# Altium schematic sheet esp32-devkit-evse_2023-04-27.schdoc
size 347 x 264 mm
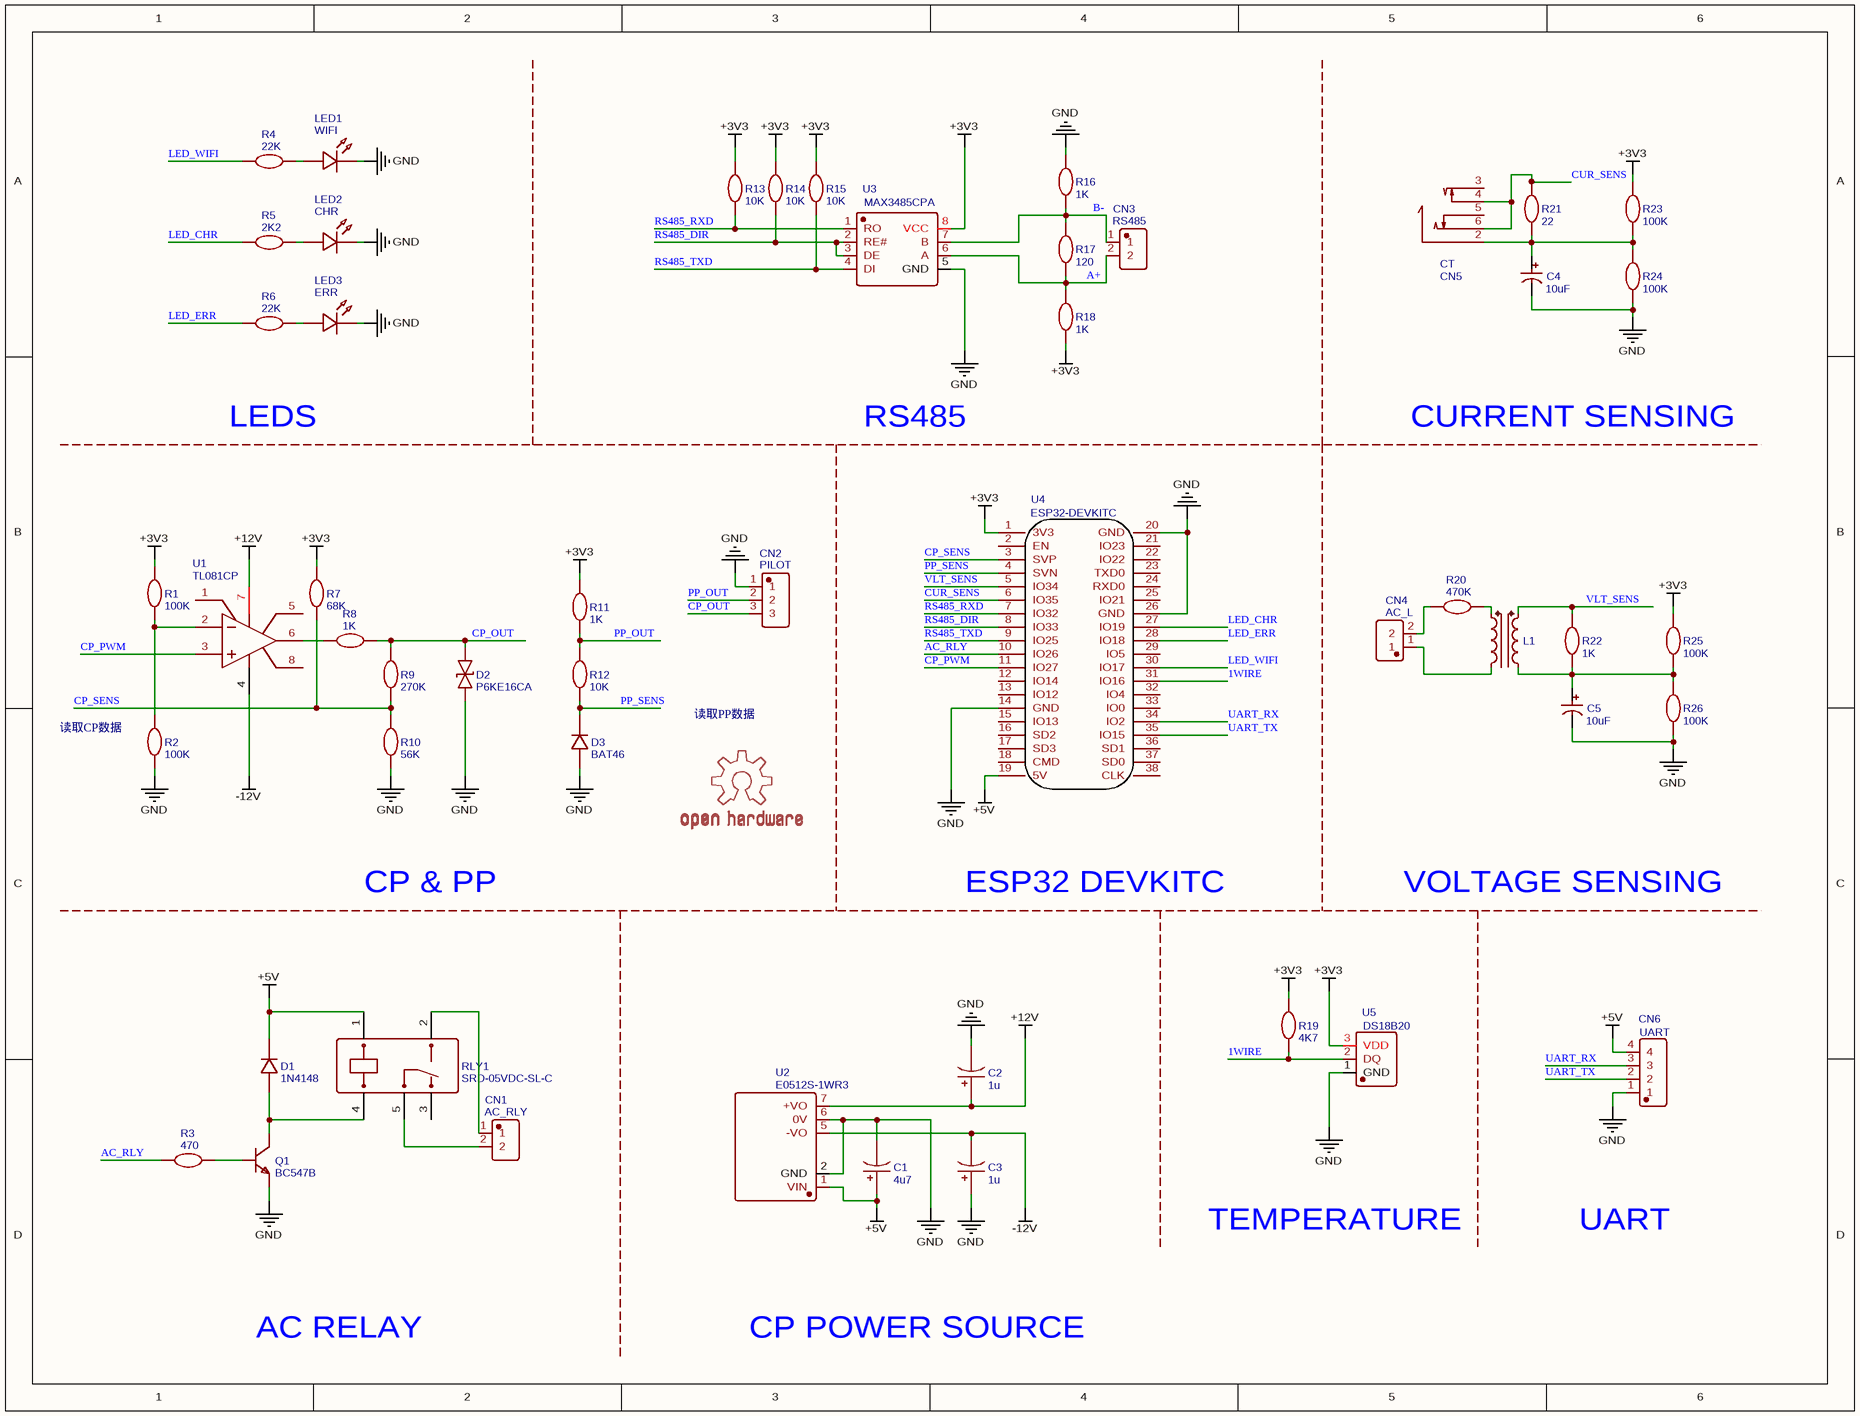
[diagram p0: esp32-devkit-evse_2023-04-27.schdoc]

## Parts
C1  4u7  [CAP-D5.0×F2.0]
C2  1u  [CAP-D5.0×F2.0]
C3  1u  [CAP-D5.0×F2.0]
C4  10uF  [CAP-TH_BD5.0-P2.00-D0.8-FD]
C5  10uF  [CAP-TH_BD5.0-P2.00-D0.8-FD]
CN1  AC_RLY  [CONN-TH_P5.00_KF301-5.0-2P]
CN2  PILOT  [CONN-TH_3P-P5.00_KF301-5.0-3P]
CN3  RS485  [CONN-TH_P5.00_KF301-5.0-2P]
CN4  AC_L  [CONN-TH_P5.00_KF301-5.0-2P]
CN5  CT  [AUDIO-TH_HOOYA_PJ-358]
CN6  UART  [CONN-TH_B4B-XH-A-G]
D1  1N4148  [DO-35_BD2.0-L4.2-P8.20-D0.5-RD]
D2  P6KE16CA  [DO-15_BD3.1-L6.7-P10.70-D0.9-BI]
D3  BAT46  [DO-35_BD2.0-L4.2-P8.20-D0.5-RD]
L1  Qingxian  [ZMPT107-1]  (value not drawn)
LED1  WIFI  [LED-TH_BD3.0_BLUE]
LED2  CHR  [LED-TH_BD3.0_GREEN]
LED3  ERR  [LED-TH_BD3.0_RED]
LOGO1  OSHW-LOGOL  [OSHW-LOGO-L]  (value not drawn)
Q1  BC547B  [TO-92-3_L4.9-W3.7-P2.54-L]
R1  100K  [R_AXIAL-0.4]
R2  100K  [R_AXIAL-0.4]
R3  470  [R_AXIAL-0.4]
R4  22K  [R_AXIAL-0.4]
R5  2K2  [R_AXIAL-0.4]
R6  22K  [R_AXIAL-0.4]
R7  68K  [R_AXIAL-0.4]
R8  1K  [R_AXIAL-0.4]
R9  270K  [R_AXIAL-0.4]
R10  56K  [R_AXIAL-0.4]
R11  1K  [R_AXIAL-0.4]
R12  10K  [R_AXIAL-0.4]
R13  10K  [R_AXIAL-0.4]
R14  10K  [R_AXIAL-0.4]
R15  10K  [R_AXIAL-0.4]
R16  1K  [R_AXIAL-0.4]
R17  120  [R_AXIAL-0.4]
R18  1K  [R_AXIAL-0.4]
R19  4K7  [R_AXIAL-0.4]
R20  470K  [R_AXIAL-0.4]
R21  22  [R_AXIAL-0.4]
R22  1K  [R_AXIAL-0.4]
R23  100K  [R_AXIAL-0.4]
R24  100K  [R_AXIAL-0.4]
R25  100K  [R_AXIAL-0.4]
R26  100K  [R_AXIAL-0.4]
RLY1  SRD-05VDC-SL-C  [RELAY-TH_SRD-XXVDC-XL-C]
U1  TL081CP  [PDIP-8_L9.3-W6.4-P2.54-LS7.6-BL]
U2  E0512S-1WR3  [PWRM-TH_E05XXS-1WR3]
U3  MAX3485CPA  [DIP-8_L9.8-W6.6-P2.54-LS7.6-BL]
U4  ESP32-DEVKITC  [ESP32-DEVKITC-32D]
U5  DS18B20  [TO-92-3_L4.9-W3.7-P2.54-L]

## Nets
+3V3: R1.1 R7.1 R11.1 R13.1 R14.1 R15.1 R18.2 R19.1 R23.1 R25.1 U3.8(VCC) U4.1(3V3) U5.3(VDD)
+5V: C1.1 CN6.4 D1.1 RLY1.1 U2.1(VIN) U4.19(5V)
+12V: C2.1 U1.7(V+) U2.7(+VO)
-12V: C3.2 U1.4(V-) U2.5(-VO)
GND: C1.2 C2.2 C3.1 C4.2 C5.2 CN2.1 CN6.1 D2.1(K) D3.2 LED1.2 LED2.2 LED3.2 Q1.3(E) R2.2 R10.2 R16.1 R24.2 R26.2 U2.2(GND) U2.6(0V) U3.5(GND) U4.14(GND) U4.20(GND) U4.26(GND) U5.1(GND)
1WIRE: R19.2 U4.31(IO16) U5.2(DQ)
A+: CN3.2 R17.2 R18.1 U3.6(A)
AC_RLY: R3.1 U4.10(IO26)
B-: CN3.1 R16.2 R17.1 U3.7(B)
CP_OUT: CN2.3 D2.2(A) R8.2 R9.1
CP_PWM: U1.3(IN+) U4.11(IO27)
CP_SENS: R7.2 R9.2 R10.1 U4.3(SVP)
CUR_SENS: CN5.4 CN5.6 R21.1 U4.6(IO35)
LED_CHR: R5.1 U4.27(IO19)
LED_ERR: R6.1 U4.28(IO18)
LED_WIFI: R4.1 U4.30(IO17)
PP_OUT: CN2.2 R11.2 R12.1
PP_SENS: D3.1 R12.2 U4.4(SVN)
RS485_DIR: R14.2 U3.2(RE#) U3.3(DE) U4.8(IO33)
RS485_RXD: R13.2 U3.1(RO) U4.7(IO32)
RS485_TXD: R15.2 U3.4(DI) U4.9(IO25)
UART_RX: CN6.3 U4.34(IO2)
UART_TX: CN6.2 U4.35(IO15)
VLT_SENS: L1.1 R22.1 U4.5(IO34)
NetC4_1: C4.1 CN5.2 R21.2 R23.2 R24.1
NetC5_1: C5.1 L1.2 R22.2 R25.2 R26.1
NetCN1_1: CN1.1 RLY1.2
NetCN1_2: CN1.2 RLY1.5
NetCN4_1: CN4.1 L1.4
NetCN4_2: CN4.2 R20.1
NetD1_2: D1.2 Q1.1(C) RLY1.4
NetL1_3: L1.3 R20.2
NetLED1_1: LED1.1 R4.2
NetLED2_1: LED2.1 R5.2
NetLED3_1: LED3.1 R6.2
NetQ1_2: Q1.2(B) R3.2
NetR1_2: R1.2 R2.1 U1.2(IN-)
NetR8_1: R8.1 U1.6(OUT)

Not connected (* = marked no-connect by the designer): CN5 3 5; RLY1 3; U1 1(OS_NULL) 5(OS_NULL) 8(NC); U4 2(EN) 12(IO14) 13(IO12) 15(IO13) 16(SD2) 17(SD3) 18(CMD) 21(IO23) 22(IO22) 23(TXD0) 24(RXD0) 25(IO21) 29(IO5) 32(IO4) 33(IO0) 36(SD1) 37(SD0) 38(CLK)

## Notes on the sheet
- LEDS
- RS485
- CURRENT SENSING
- 读取CP数据
- 读取PP数据
- CP & PP
- ESP32 DEVKITC
- VOLTAGE SENSING
- TEMPERATURE
- UART
- AC RELAY
- CP POWER SOURCE

## Library data of the parts
C1 = 4u7: nameAlias: Value(F); Contributor: LCEDA_Lib; spicePre: C; spiceSymbolName: CE_TH_D5.0×F2.0_US
C2 C3 = 1u: nameAlias: Value(F); Contributor: LCEDA_Lib; spicePre: C; spiceSymbolName: CE_TH_D5.0×F2.0_US
C4 C5 = 10uF: BOM_Manufacturer: ValuePro; BOM_Manufacturer Part: 10uF 25V 5*11; nameAlias: Capacitance; BOM_Supplier: LCSC; BOM_Supplier Part: C43347; spicePre: C; spiceSymbolName: 10uF 25V 5*11
CN1 = AC_RLY: BOM_Manufacturer: Cixi Kefa Elec; BOM_Manufacturer Part: KF301-5.0-2P; Contributor: LCSC; Package Display: No; BOM_Supplier: LCSC; BOM_Supplier Part: C474881; spicePre: U; spiceSymbolName: KF301-5.0-2P
CN2 = PILOT: BOM_Manufacturer: Cixi Kefa Elec; BOM_Manufacturer Part: KF301-5.0-3P; Contributor: LCSC; BOM_Supplier: LCSC; BOM_Supplier Part: C474882; spicePre: U; spiceSymbolName: KF301-5.0-3P
CN3 = RS485: BOM_Manufacturer: Cixi Kefa Elec; BOM_Manufacturer Part: KF301-5.0-2P; Contributor: LCSC; Package Display: No; BOM_Supplier: LCSC; BOM_Supplier Part: C474881; spicePre: U; spiceSymbolName: KF301-5.0-2P
CN4 = AC_L: BOM_Manufacturer: Cixi Kefa Elec; BOM_Manufacturer Part: KF301-5.0-2P; Contributor: LCSC; Package Display: No; BOM_Supplier: LCSC; BOM_Supplier Part: C474881; spicePre: U; spiceSymbolName: KF301-5.0-2P
CN5 = CT: BOM_Manufacturer: HOOYA(香港皓宇); BOM_Manufacturer Part: PJ-358; Contributor: LCSC; BOM_Supplier: LCSC; BOM_Supplier Part: C2939193; spicePre: C; spiceSymbolName: PJ-358
CN6 = UART: BOM_Manufacturer: JST; BOM_Manufacturer Part: B4B-XH-A-G; Contributor: LCSC; BOM_Supplier: LCSC; BOM_Supplier Part: C594232; BOM_JLCPCB Part Class: Extended Part; spicePre: U; spiceSymbolName: B4B-XH-A-G
D1 = 1N4148: BOM_Manufacturer: STMicroelectronics; Contributor: LCSC; BOM_Supplier: LCSC; BOM_Supplier Part: C13769; BOM_Manufacturer Part: 1N4148; spicePre: D; spiceSymbolName: 1N4148
D2 = P6KE16CA: BOM_Manufacturer: Yenji Elec; Contributor: LCSC; BOM_Supplier: LCSC; BOM_Supplier Part: C157801; BOM_Manufacturer Part: P6KE16CA; spicePre: D; spiceSymbolName: P6KE16CA_C157801
D3 = BAT46: Contributor: LCSC; spicePre: D; spiceSymbolName: 1N4148
L1 = Qingxian: BOM_Manufacturer: Qingxian Zeming Langxi Elec; BOM_Manufacturer Part: ZMPT107; nameAlias: Value; Contributor: LCSC; BOM_Supplier: LCSC; BOM_Supplier Part: C94572; spicePre: L; spiceSymbolName: ZMPT107
LED1 = WIFI: BOM_Manufacturer: EVERLIGHT(台湾亿光); BOM_Manufacturer Part: 204-10SUBC/S400-A4; Contributor: LCEDA_Lib; BOM_Supplier Part: C86881; BOM_Supplier: LCSC; spicePre: L; spiceSymbolName: LED-TH-3mm_B
LED2 = CHR: BOM_Manufacturer: EVERLIGHT(台湾亿光); BOM_Manufacturer Part: 204-10SYGD/S530-E3; Contributor: LCEDA_Lib; BOM_Supplier Part: C85161; spicePre: L; spiceSymbolName: LED-TH-3mm_G
LED3 = ERR: BOM_Manufacturer: EVERLIGHT(台湾亿光); BOM_Manufacturer Part: 204-10SDRD/S530-A3-L; Contributor: LCEDA_Lib; BOM_Supplier Part: C84774; BOM_Supplier: LCSC; spicePre: L; spiceSymbolName: LED-TH-3mm_R
LOGO1 = OSHW-LOGOL: Contributor: David Asassin; spicePre: L; spiceSymbolName: OSHW-LOGOL
Q1 = BC547B: BOM_Manufacturer: CJ; BOM_Manufacturer Part: BC547B Tube; BOM_Supplier: LCSC; BOM_Supplier Part: C2092; BOM_JLCPCB Part Class: Extended Part; spicePre: Q; spiceSymbolName: BC547B Tube
R1 R2 R23-R26 = 100K: nameAlias: Value(Ω); Contributor: LCEDA_Lib; spicePre: R; spiceSymbolName: R_AXIAL-0.4_EU
R3 = 470: nameAlias: Value(Ω); Contributor: LCEDA_Lib; spicePre: R; spiceSymbolName: R_AXIAL-0.4_EU
R4 R6 = 22K: nameAlias: Value(Ω); Contributor: LCEDA_Lib; spicePre: R; spiceSymbolName: R_AXIAL-0.4_EU
R5 = 2K2: nameAlias: Value(Ω); Contributor: LCEDA_Lib; spicePre: R; spiceSymbolName: R_AXIAL-0.4_EU
R7 = 68K: nameAlias: Value(Ω); Contributor: LCEDA_Lib; spicePre: R; spiceSymbolName: R_AXIAL-0.4_EU
R8 R11 R16 R18 R22 = 1K: nameAlias: Value(Ω); Contributor: LCEDA_Lib; spicePre: R; spiceSymbolName: R_AXIAL-0.4_EU
R9 = 270K: nameAlias: Value(Ω); Contributor: LCEDA_Lib; spicePre: R; spiceSymbolName: R_AXIAL-0.4_EU
R10 = 56K: nameAlias: Value(Ω); Contributor: LCEDA_Lib; spicePre: R; spiceSymbolName: R_AXIAL-0.4_EU
R12-R15 = 10K: nameAlias: Value(Ω); Contributor: LCEDA_Lib; spicePre: R; spiceSymbolName: R_AXIAL-0.4_EU
R17 = 120: nameAlias: Value(Ω); Contributor: LCEDA_Lib; spicePre: R; spiceSymbolName: R_AXIAL-0.4_EU
R19 = 4K7: nameAlias: Value(Ω); Contributor: LCEDA_Lib; spicePre: R; spiceSymbolName: R_AXIAL-0.4_EU
R20 = 470K: nameAlias: Value(Ω); Contributor: LCEDA_Lib; spicePre: R; spiceSymbolName: R_AXIAL-0.4_EU
R21 = 22: nameAlias: Value(Ω); Contributor: LCEDA_Lib; spicePre: R; spiceSymbolName: R_AXIAL-0.4_EU
RLY1 = SRD-05VDC-SL-C: BOM_Manufacturer: SONGLE; BOM_Supplier: LCSC; BOM_Manufacturer Part: SRD-05VDC-SL-C; image: //image.lceda.cn/szlcsc/C35449.jpg; BOM_Supplier Part: C35449; spicePre: R; spiceSymbolName: SRD-05VDC-SL-C
U1 = TL081CP: BOM_Manufacturer: TI; BOM_Supplier: LCSC; BOM_Manufacturer Part: TL081CP; BOM_Supplier Part: C38969; BOM_JLCPCB Part Class: Extended Part; spicePre: U; spiceSymbolName: TL081CP
U2 = E0512S-1WR3: BOM_Manufacturer: MORNSUN Guangzhou S& T; Contributor: LCSC; BOM_Supplier: LCSC; BOM_Supplier Part: C189421; BOM_Manufacturer Part: E0512S-1WR3; spicePre: U; spiceSymbolName: E0512S-1WR3
U3 = MAX3485CPA: BOM_Manufacturer: MAXIM; BOM_Supplier: LCSC; BOM_Manufacturer Part: MAX3485CPA; BOM_Supplier Part: C9944; BOM_JLCPCB Part Class: Extended Part; spicePre: U; spiceSymbolName: MAX3485CPA
U4 = ESP32-DEVKITC: BOM_Manufacturer: ESPRESSIF; Contributor: Ad007; BOM_Manufacturer Part: ESP32-DEVKITC-32D; BOM_Supplier: TME; BOM_Supplier Part: ESP32-DEVKITC-32D; link: https://www.tme.eu/pl/details/esp32-devkitc-32d/zestawy-do-transmisji-danych/espressif/; spicePre: U; spiceSymbolName: ESP32-DEVKITC-32D
U5 = DS18B20: BOM_Manufacturer: MAXIM(美信); BOM_Manufacturer Part: DS18B20+T&R; Contributor: LCSC; BOM_Supplier: LCSC; BOM_Supplier Part: C880672; BOM_JLCPCB Part Class: Extended Part; spicePre: U; spiceSymbolName: DS18B20+T&amp;R